# EAGLE schematic RiseUp (EAGLE 9.5.2)
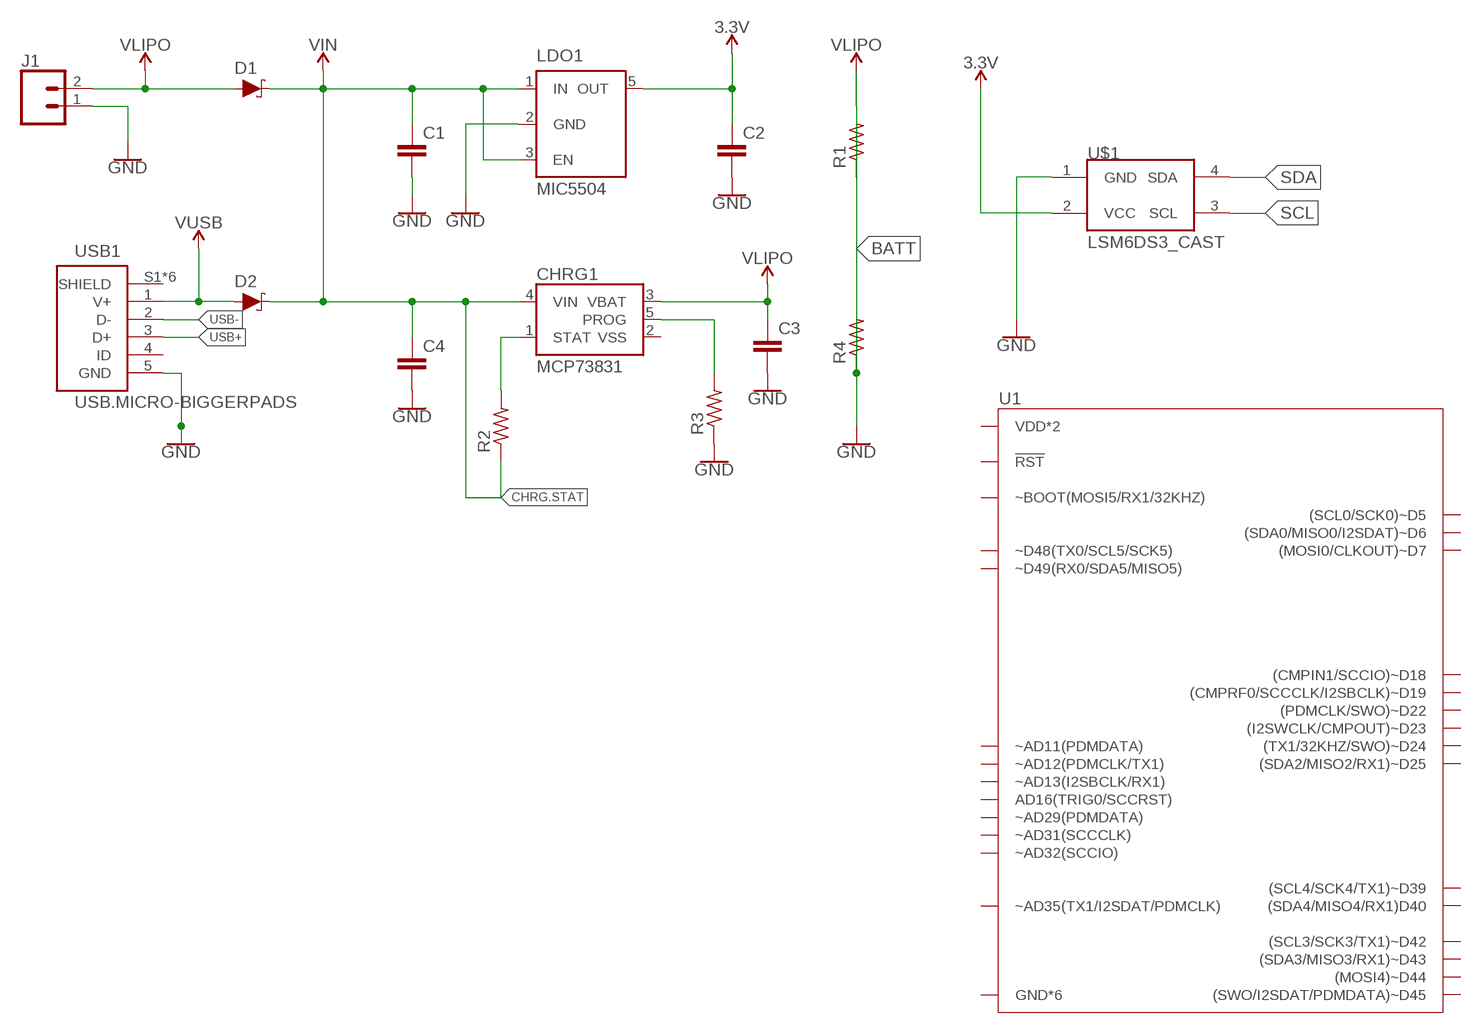
[diagram p0: schematic, sheet 1]

## Parts
C1  CAPACITOR0603  [C0603]
C2  CAPACITOR0603  [C0603]
C3  CAPACITOR0603  [C0603]
C4  CAPACITOR0603  [C0603]
CHRG1  MCP73831  [SOT23-5]
D1  SCHOTTKY-USC  [USC]
D2  SCHOTTKY-USC  [USC]
J1  CONN_02  [1X02]
LDO1  MIC5504  [SOT23-5]
R1  RESISTOR0603  [R0603]
R2  RESISTOR0603  [R0603]
R3  RESISTOR0603  [R0603]
R4  RESISTOR0603  [R0603]
U1  ARTEMIS.CAST  [ARTEMIS_CAST]
U$1  LSM6DS3_CAST  [LSM6DS3_CAST]
USB1  USB.MICRO-BIGGERPADS  [USB-MICRO-01.BIGGERPADS]

## Nets
3.3V: C2.1 LDO1.5(OUT) U$1.2(VCC)
BATT: R1.1 R4.2
CHRG.STAT: C1.1 C4.1 CHRG1.4(VIN) D1.-(C) D2.-(C) LDO1.1(IN) LDO1.3(EN) R2.1 ; supply symbol labelled VIN
GND: C1.2 C2.2 C3.2 C4.2 J1.1 LDO1.2(GND) R1.2 R3.1 R4.1 U$1.1(GND) USB1.5(GND) ; supply symbol labelled VLIPO
N$5: CHRG1.1(STAT) R2.2
N$9: CHRG1.5(PROG) R3.2
SCL: U$1.3(SCL)
SDA: U$1.4(SDA)
USB+: USB1.3(D+)
USB-: USB1.2(D-)
V_USB: D2.+(A) USB1.1(V+) ; supply symbol labelled VUSB
VLIPO: C3.1 CHRG1.3(VBAT) D1.+(A) J1.2
Unconnected: U1.1(~D49(RX0/SDA5/MISO5)) U1.2((SCL4/SCK4/TX1)~D39) U1.3((SDA4/MISO4/RX1)D40) U1.4(~BOOT(MOSI5/RX1/32KHZ)) U1.5(~D48(TX0/SCL5/SCK5)) U1.6((SCL0/SCK0)~D5) U1.7((MOSI0/CLKOUT)~D7) U1.8(~AD35(TX1/I2SDAT/PDMCLK)) U1.9((TX1/32KHZ/SWO)~D24) U1.10((PDMCLK/SWO)~D22) U1.11((I2SWCLK/CMPOUT)~D23) U1.12((SDA0/MISO0/I2SDAT)~D6) U1.13(~AD32(SCCIO)) U1.14((SDA2/MISO2/RX1)~D25) U1.15(~AD12(PDMCLK/TX1)) U1.16(~AD13(I2SBCLK/RX1)) U1.17(VDD*2) U1.18(~AD29(PDMDATA)) U1.19(~AD11(PDMDATA)) U1.20((CMPRF0/SCCCLK/I2SBCLK)~D19) U1.21((CMPIN1/SCCIO)~D18) U1.22(AD16(TRIG0/SCCRST)) U1.23(~AD31(SCCCLK)) U1.24((SWO/I2SDAT/PDMDATA)~D45) U1.25(!RST) U1.26((SDA3/MISO3/RX1)~D43) U1.27((SCL3/SCK3/TX1)~D42) U1.28((MOSI4)~D44) U1.29(GND*6) USB1.4(ID) USB1.S1(SHIELD) USB1.S2(SHIELD) USB1.S3(SHIELD) USB1.S4(SHIELD) USB1.S5(SHIELD) USB1.S6(SHIELD)

## Power pins joined to a net without a drawn wire
VSS: CHRG1.2(VSS)

## Library data of the parts
C1-C4 = LinnesLab-Passives:CAPACITOR
CHRG1 = LinnesLab-Power:MCP73831: MCP73831T Li-Ion, Li-Pol Controller Miniature single cell, fully integrated Li-Ion, Li-polymer charge management controller Datasheet <http://ww1.microchip.com/downloads/en/DeviceDoc/20001984g.pdf> SparkFun Products: SparkFun ESP32 Thing <https://www.sparkfun.com/products/13907> SparkFun 9DoF Razor IMU M0 <https://www.sparkfun.com/products/14001>; PROD_ID: IC-09995
D1 D2 = LinnesLab-DiscreteSemi:SCHOTTKY: Schottky diode A Schottky diode is a semiconductor diode which has a low forward voltage drop and a very fast switching action. Example: Digi-Key Part Number: RB161MM-20CT-ND
J1 = LinnesLab-Connectors:CONN_02: Multi connection point. Often used as Generic Header-pin footprint for 0.1 inch spaced/style header connections On any of the 0.1 inch spaced packages, you can populate with these: Break Away Headers - Straight <https://www.sparkfun.com/products/116> (PRT-00116) Break Away Male Headers - Right Angle <https://www.sparkfun.com/products/553> (PRT-00553) Female Headers <https://www.sparkfun.com/products/115> (PRT-00115) Break Away Headers - Machine Pin <https://www.sparkfun.com/products/117> (PRT-00117) Break Away Female Headers - Swiss Machine Pin <https://www.sparkfun.com/products/743> (PRT-00743) For SCREWTERMINALS and SPRING TERMINALS visit here: Screw Terimnals on SparkFun.com <https://www.sparkfun.com/search/results?term=Screw+Terminals> (5mm/3.5mm/2.54mm spacing) This device is also useful as a general connection point to wire up your design to another part of your project. Our various solder wires solder well into these plated through hole pads. Hook-Up Wire - Assortment (Stranded, 22 AWG) <https://www.sparkfun.com/products/11375> (PRT-11375) Hook-Up Wire - Assortment (Solid Core, 22 AWG) <https://www.sparkfun.com/products/11367> (PRT-11367) View the entire wire category on our website here <https://www.sparkfun.com/categories/141> Special notes: Molex polarized connector foot print use with: PRT-08233 with associated crimp pins and housings. 2.54_SCREWTERM for use with PRT-10571. 3.5mm Screw Terminal footprints for PRT-08084 5mm Screw Terminal footprints for use with PRT-08432
LDO1 = LinnesLab-Power:MIC5504: MIC5504 Voltage Regulator Output Voltages: 1.0V to 3.3V Input Voltages: 2.5V to 5.5V Link to Datasheet http://ww1.microchip.com/downloads/en/DeviceDoc/MIC550X.pdf
R1-R4 = LinnesLab-Passives:RESISTOR
U1 = LinnesLab-Microcontrollers:ARTEMIS.CAST
U$1 = LinnesLab-Sensors:LSM6DS3_CAST
USB1 = LinnesLab-Connectors:USB.MICRO: DigiKey PN: 609-4613-1-ND